# Altium schematic sheet [03] - WiFi.SchDoc
size A4
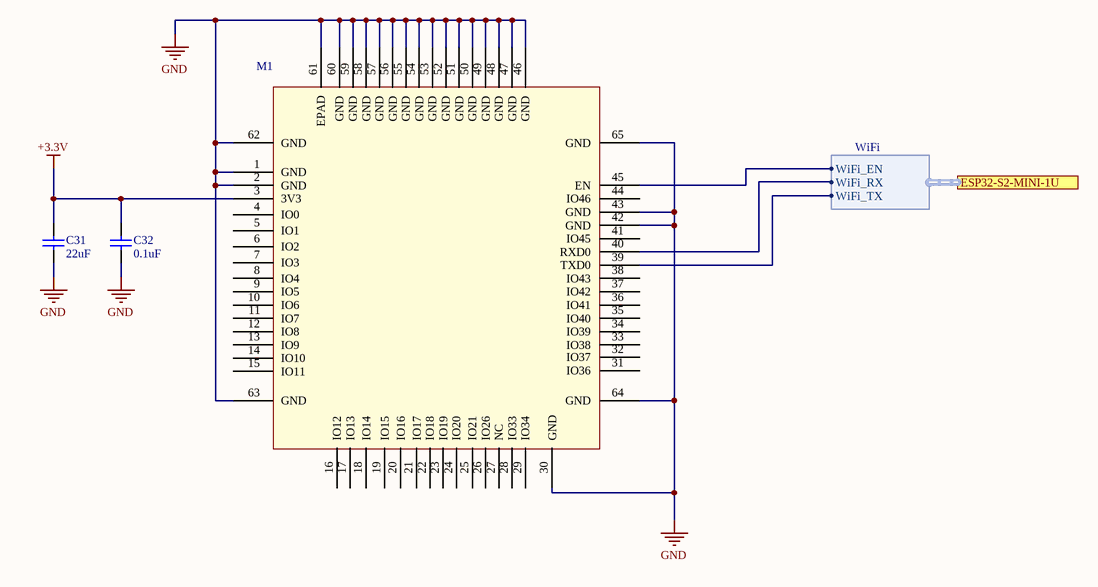
[diagram p0: [03] - WiFi.SchDoc]

## Parts
C31  value 22uF  [SMD(0805)]  (hidden comment: Cap)
C32  value 0.1uF  [SMD(0805)]  (hidden comment: Cap)
M1  ESP32-S2-MINI-1U _Module  (value not drawn)

## Ports
ESP32-S2-MINI-1U (harness WiFi)

## Harnesses
WiFi: WiFi_EN, WiFi_RX, WiFi_TX

## Nets
+3.3V: C31.2 C32.2 M1.3(3V3)
GND: C31.1 C32.1 M1.1(GND) M1.2(GND) M1.30(GND) M1.42(GND) M1.43(GND) M1.46(GND) M1.47(GND) M1.48(GND) M1.49(GND) M1.50(GND) M1.51(GND) M1.52(GND) M1.53(GND) M1.54(GND) M1.55(GND) M1.56(GND) M1.57(GND) M1.58(GND) M1.59(GND) M1.60(GND) M1.61(EPAD) M1.62(GND) M1.63(GND) M1.64(GND) M1.65(GND)
NetM1_39: M1.39(TXD0) ; port ESP32-S2-MINI-1U.WiFi_TX
NetM1_40: M1.40(RXD0) ; port ESP32-S2-MINI-1U.WiFi_RX
NetM1_45: M1.45(EN) ; port ESP32-S2-MINI-1U.WiFi_EN

Not connected (* = marked no-connect by the designer): M1 4(IO0) 5(IO1) 6(IO2) 7(IO3) 8(IO4) 9(IO5) 10(IO6) 11(IO7) 12(IO8) 13(IO9) 14(IO10) 15(IO11) 16(IO12) 17(IO13) 18(IO14) 19(IO15) 20(IO16) 21(IO17) 22(IO18) 23(IO19) 24(IO20) 25(IO21) 26(IO26) 27(NC) 28(IO33) 29(IO34) 31(IO36) 32(IO37) 33(IO38) 34(IO39) 35(IO40) 36(IO41) 37(IO42) 38(IO43) 41(IO45) 44(IO46)

## Notes on the sheet
- Title
- Size:
- Date:
- A4
- Number:
- Time:
- Revision:
- Sheet
- of
- File:

## Library data of the parts
C31 C32 = Cap: Capacitor
M1 = ESP32-S2-MINI-1U _Module: Esp-32-S2-MINI-1U; Datasheet: https://www.espressif.com/en/support/download/documents